# EAGLE design minutka_tlacitka (EAGLE 9.6.2)
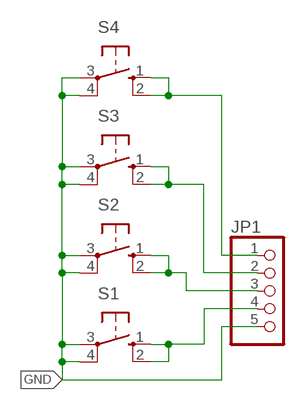
[diagram p0: schematic, sheet 1]

## Parts
JP1  PINHD-1X5  [1X05]
S1  40-XX  [B3F-40XX]
S2  40-XX  [B3F-40XX]
S3  40-XX  [B3F-40XX]
S4  40-XX  [B3F-40XX]

## Nets
GND: JP1.5 S1.3(P) S1.4(P1) S2.3(P) S2.4(P1) S3.3(P) S3.4(P1) S4.3(P) S4.4(P1)
N$2: JP1.3 S2.1(S) S2.2(S1)
N$5: JP1.1 S4.1(S) S4.2(S1)
N$6: JP1.2 S3.1(S) S3.2(S1)
N$8: JP1.4 S1.1(S) S1.2(S1)

## Library data of the parts
JP1 = pinhead:PINHD-1X5: PIN HEADER
S1-S4 = switch-omron:40-XX: OMRON SWITCH; MF: OMRON COMPONENTS USA; MPN: B3F-4000; OC_FARNELL: 176434; OC_NEWARK: 36K3105

## Board
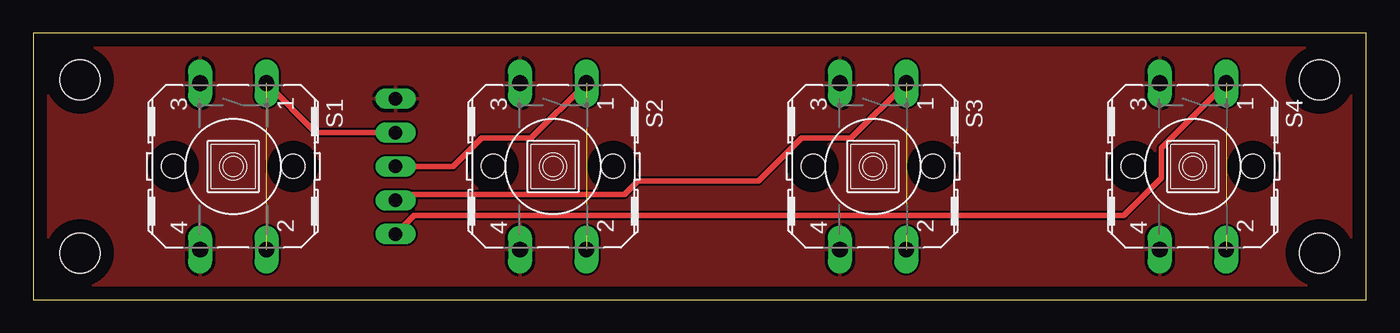
[diagram p1: board, top side]
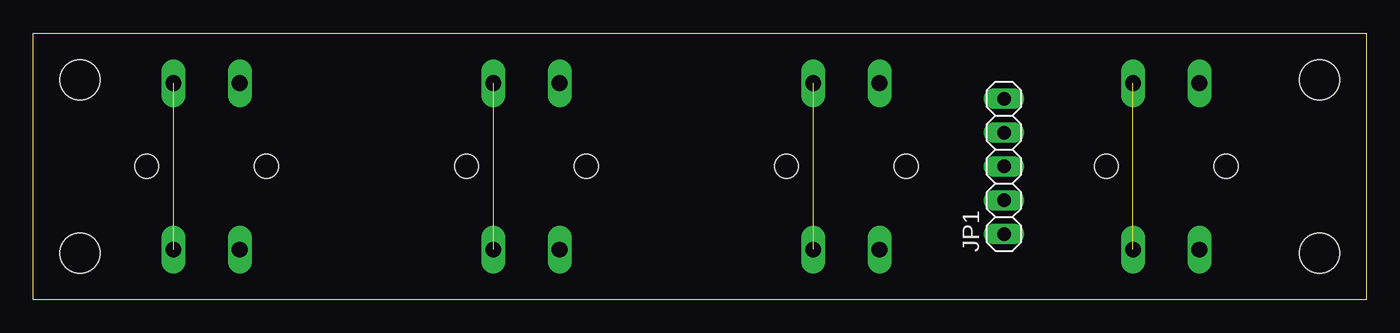
[diagram p2: board, bottom side, seen from below]

Size 100 x 20 mm. Coordinates in mm from the lower left corner, seen from the top.
Outline: 0,0 100,0 100,20 0,20 0,0
Copper layers (1*16): Top 0.035mm / dielectric 1mm / Bottom 0.035mm
Design rules "default *": minimum track width 6mil, minimum drill 0.35mm, track to track 6mil, track to pad 6mil, pad to pad 6mil, via to via 6mil, smd to smd 6mil, copper to edge 40mil, drill to drill 6mil, minimum pad ring 10mil, minimum via ring 8mil, stop-mask expansion 4mil, vias tented up to drill 0mil, thermal gap 10mil
Holes 3 mm at 3.5,3.5 96.5,3.5 96.5,16.5 3.5,16.5

### Footprints (pad centres in the part's own frame; a part is rotated, then mirrored left to right if it is on the bottom)
1X05 = drill 1.016 long: 1 -5.08,0; 2 -2.54,0; 3 0,0; 4 2.54,0; 5 5.08,0
B3F-40XX = drill 1.194 long: 1 -6.248,2.489; 2 6.248,2.489; 3 -6.248,-2.489; 4 6.248,-2.489 | hole 1.803: 0,-4.496; 0,4.496

### Placement (x,y rotation side)
JP1  27.18,10 90 bottom
S1  15,10 270 top
S2  39,10 270 top
S3  63,10 270 top
S4  87,10 270 top

### Tracks (layer width: path | path; a pad name or v marks a point on that pad's centre or on a via)
GND
  pour Top: 0,0 101.6,0 101.6,21.59 0,21.59
N$2  (1 unrouted)
  Top 0.406: S2.1 37.36,12.12 33.63,12.12 31.5,10 JP1.3
N$5  (1 unrouted)
  Top 0.406: S4.1 84.62,11.38 84.62,9.12 81.81,6.3 28.56,6.3 JP1.1
N$6  (1 unrouted)
  Top 0.406: S3.1 61.36,12.12 57.63,12.12 54.4,8.89 45.38,8.89 44.37,7.88 27.6,7.88 JP1.2
N$8  (1 unrouted)
  Top 0.406: S1.1 21.2,12.54 JP1.4